# EAGLE design Water_Bird_wagtail (EAGLE 7.3.0)
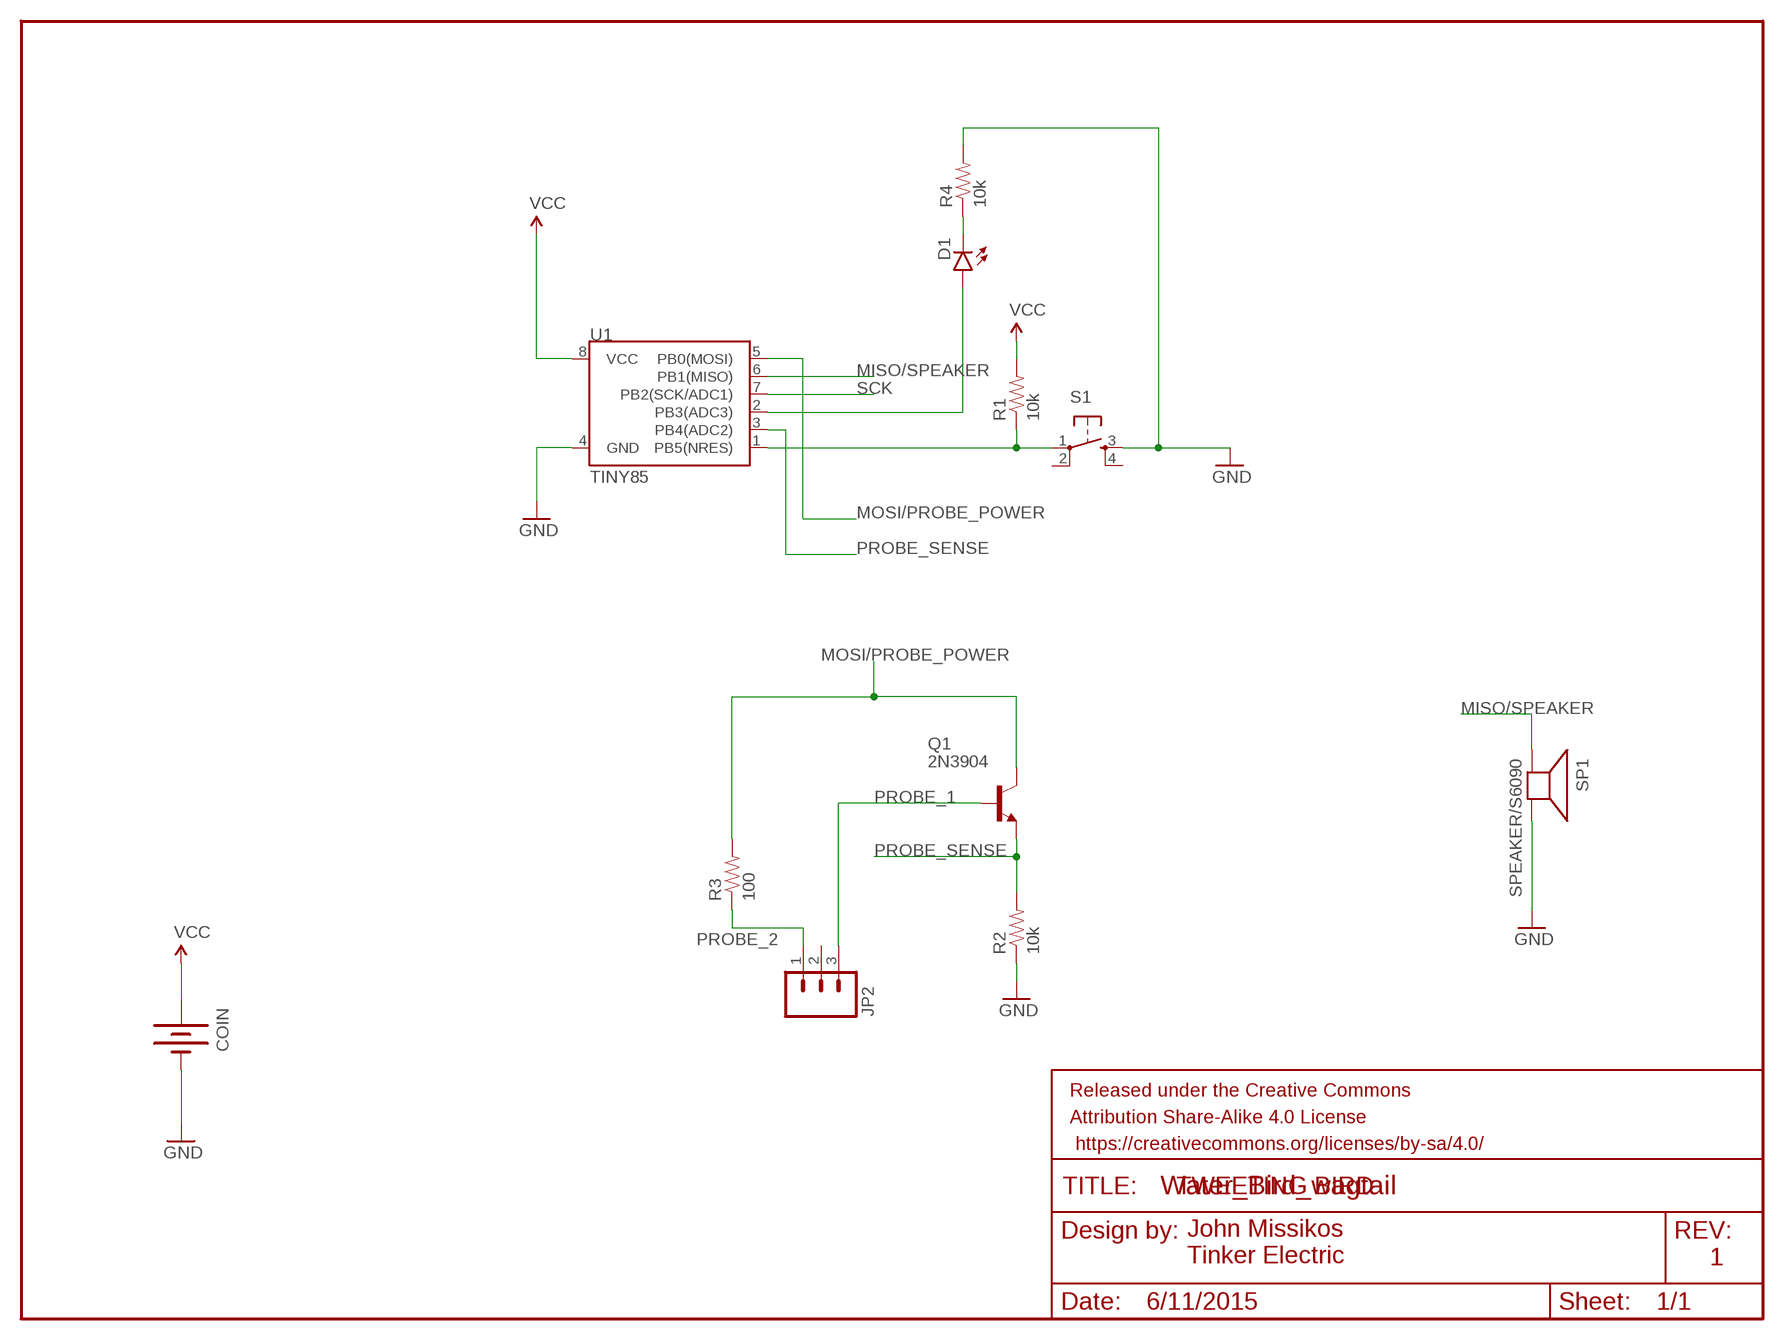
[diagram p0: schematic, sheet 1]

## Parts
COIN  BATTERY_20MM20PTH  [BATTCOM_20MM_PTH]
D1  LED5MM  [LED5MM]
FRAME1  FRAME-LETTERNO_PACKAGE  [DUMMY]
JP2  M03-SCREW-5MM  [SCREWTERMINAL-5MM-3]
Q1  2N3904  2N2222  [TO92-EBC-OVAL]
R1  10k  RESISTORAXIAL-0.3  [AXIAL-0.3]
R2  10k  RESISTORAXIAL-0.3  [AXIAL-0.3]
R3  100  RESISTORAXIAL-0.3  [AXIAL-0.3]
R4  10k  RESISTORAXIAL-0.3  [AXIAL-0.3]
S1  TAC_SWITCHPTH  [TACTILE-PTH]
SP1  SPEAKER/S6090  [S6090]
U1  TINY85  ATTINY45TINY85-20-DIP  [DIP08]

## Nets
GND: COIN.2(-) R2.P$1 R4.P$2 S1.3 SP1.2(-) U1.4(GND)
MISO/SPEAKER: SP1.1(+) U1.6(PB1(MISO))
MOSI/PROBE_POWER: Q1.C R3.P$2 U1.5(PB0(MOSI))
N$1: D1.A U1.2(PB3(ADC3))
N$3: D1.K(C) R4.P$1
PROBE_1: JP2.3 Q1.B
PROBE_2: JP2.1 R3.P$1
PROBE_SENSE: Q1.E R2.P$2 U1.3(PB4(ADC2))
RESET: R1.P$1 S1.1 U1.1(PB5(NRES))
SCK: U1.7(PB2(SCK/ADC1))
VCC: COIN.1(+) R1.P$2 U1.8(VCC)
Unconnected: JP2.2 S1.2 S1.4

## Notes on the sheet
- TWEETING BIRD
- John Missikos
  Tinker Electric
- 1
- 6/11/2015

## Library data of the parts
COIN = TinkerElectric:BATTERY_20MM: Battery Holders Various common sizes : AA, AAA, 18650 (PRT-12895), 20mm coin cell and 12mm coin cell. 20MM_4LEGS, BATT-10373
D1 = SparkFun-LED:LED: LEDs Standard schematic elements and footprints for 5mm, 3mm, 1206, and 0603 sized LEDs. 5mm - Spark Fun Electronics SKU : COM-00529 (and others)
FRAME1 = SparkFun-Aesthetics:FRAME-LETTER: Schematic Frame Standard 8.5x11 US Letter frame; DESIGNER: JM; VERSION: v01
JP2 = SparkFun-Connectors:M03: Header 3 Standard 3-pin 0.1" header. Use with straight break away headers (SKU : PRT-00116), right angle break away headers (PRT-00553), swiss pins (PRT-00743), machine pins (PRT-00117), and female headers (PRT-00115). Molex polarized connector foot print use with SKU : PRT-08232 with associated crimp pins and housings.; STOREFRONT_ID: PRT-08433
Q1 = adafruit:2N2222: NPN TRANSISTOR Big oval pads
R1-R4 = SparkFun-Passives:RESISTOR: Resistor Basic schematic elements and footprints for 0603, 1206, and PTH resistors.
S1 = SparkFun-Retired:TAC_SWITCH: Momentary Switch Button commonly used for reset or general input. Spark Fun Electronics SKU : COM-00097 SMT- SWCH-08247
SP1 = TinkerElectric:SPEAKER: SPEAKER Source: Buerklin Added PS12 (for part # PS1240 piezo) http://www.ladyada.net/library/pcb/eaglelibrary.html
U1 = SparkFun-DigitalIC:ATTINY45: Atmel 8-pin 2/4/8kB flash uC; PROD_ID: IC-09445; VALUE: TINY85-20-DIP

## Board
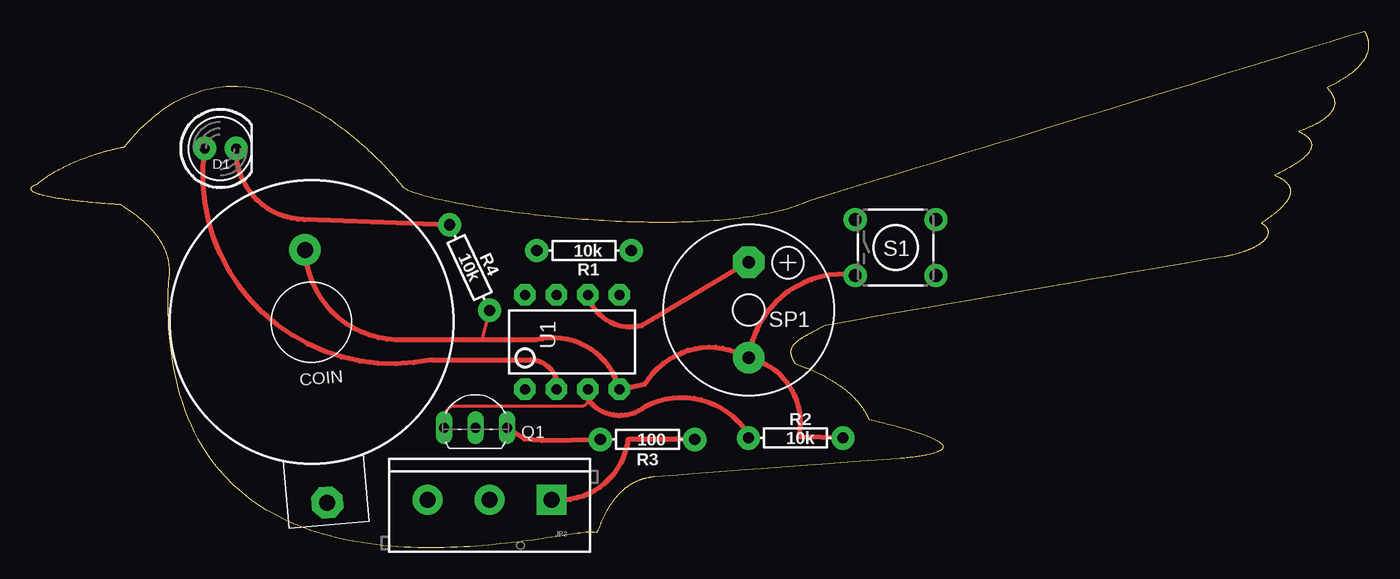
[diagram p1: board, top side]
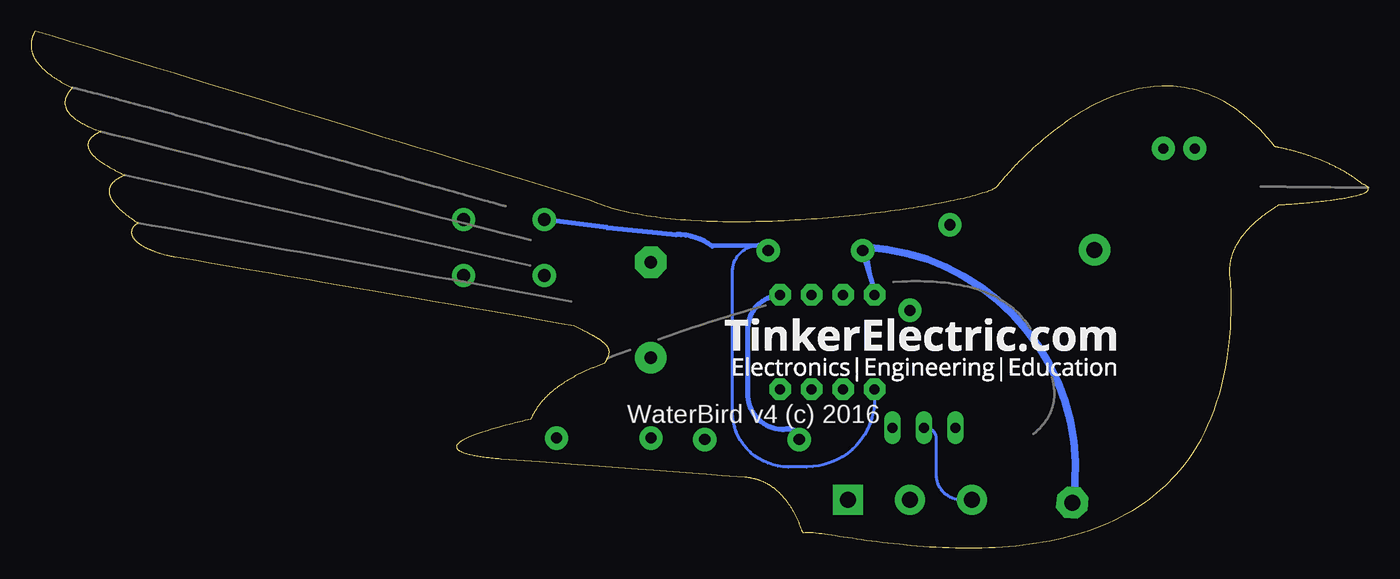
[diagram p2: board, bottom side, seen from below]

Size 107.9 x 41.72 mm. Coordinates in mm from the lower left corner, seen from the top.
Outline: 96.6,23.57 94.56,23.22 93.55,23.04 90.5,22.52 89.48,22.34 88.46,22.17 87.45,21.99 85.42,21.64 84.4,21.46 81.35,20.94 80.33,20.76 78.3,20.41 77.28,20.23 75.25,19.88 74.23,19.71 72.2,19.36 71.19,19.18 68.14,18.65 67.12,18.48 65.09,18.13 64.07,17.95 63.99,17.91 63.91,17.87 63.83,17.83 63.76,17.79 63.68,17.75 63.61,17.71 63.53,17.67 63.46,17.63 63.39,17.59 63.32,17.56 63.25,17.52 63.18,17.49 63.12,17.45 63.05,17.42 62.99,17.38 62.93,17.35 62.87,17.31 62.81,17.28 62.75,17.25 62.69,17.22 62.63,17.18 62.58,17.15 62.52,17.12 62.47,17.09 62.42,17.06 62.37,17.03 62.32,17 62.27,16.97 62.22,16.94 62.18,16.91 62.13,16.88 62.09,16.86 62.05,16.83 62.01,16.8 61.97,16.77 61.89,16.72 61.85,16.69 61.82,16.66 61.78,16.63 61.75,16.61 61.72,16.58 61.69,16.55 61.66,16.53 61.63,16.5 61.6,16.47 61.58,16.44 61.55,16.42 61.53,16.39 61.51,16.36 61.48,16.34 61.46,16.31 61.44,16.28 61.41,16.23 61.39,16.2 61.38,16.17 61.36,16.15 61.35,16.12 61.34,16.09 61.33,16.06 61.32,16.04 61.31,16.01 61.3,15.98 61.3,15.95 61.29,15.92 61.29,15.89 61.28,15.86 61.28,15.83 61.28,15.8 61.28,15.77 61.28,15.74 61.29,15.71 61.29,15.68 61.3,15.62 61.31,15.58 61.32,15.55 61.32,15.52 61.33,15.48 61.35,15.45 61.36,15.41 61.37,15.38 61.39,15.34 61.4,15.31 61.42,15.27 61.43,15.23 61.45,15.2 61.47,15.16 61.49,15.12 61.51,15.08 61.54,15.04 61.56,15 61.59,14.96 61.61,14.92 61.64,14.87 61.74,14.84 61.84,14.8 61.94,14.76 62.04,14.73 62.14,14.69 62.23,14.65 62.33,14.61 62.42,14.58 62.52,14.54 62.61,14.5 62.7,14.46 62.8,14.42 62.89,14.38 62.98,14.34 63.07,14.31 63.15,14.27 63.24,14.23 63.33,14.19 63.41,14.15 63.5,14.1 63.58,14.06 63.67,14.02 63.75,13.98 63.83,13.94 63.91,13.9 63.99,13.86 64.15,13.77 64.23,13.73 64.3,13.69 64.38,13.64 64.45,13.6 64.53,13.56 64.6,13.51 64.67,13.47 64.74,13.42 64.82,13.38 64.89,13.34 64.95,13.29 65.02,13.25 65.09,13.2 65.16,13.15 65.22,13.11 65.29,13.06 65.35,13.02 65.42,12.97 65.48,12.92 65.54,12.88 65.6,12.83 65.66,12.78 65.78,12.69 65.84,12.64 65.89,12.59 65.95,12.54 66.01,12.49 66.06,12.44 66.12,12.4 66.17,12.35 66.22,12.3 66.27,12.25 66.32,12.2 66.37,12.15 66.42,12.1 66.47,12.05 66.52,11.99 66.56,11.94 66.61,11.89 66.7,11.79 66.74,11.74 66.79,11.69 66.83,11.63 66.87,11.58 66.91,11.53 66.95,11.48 66.99,11.42 67.03,11.37 67.07,11.32 67.1,11.26 67.17,11.15 67.21,11.1 67.24,11.04 67.27,10.99 67.31,10.93 67.37,10.82 67.4,10.77 67.43,10.71 67.45,10.66 67.48,10.6 67.51,10.54 67.54,10.49 67.56,10.43 67.58,10.37 67.81,10.32 68.03,10.27 68.24,10.22 68.45,10.17 68.65,10.12 68.85,10.07 69.05,10.02 69.24,9.97 69.61,9.87 69.79,9.83 70.14,9.73 70.31,9.69 70.47,9.64 70.63,9.59 70.78,9.55 71.08,9.46 71.22,9.41 71.49,9.33 71.62,9.28 71.74,9.24 71.87,9.2 71.98,9.16 72.09,9.12 72.2,9.08 72.31,9.03 72.41,8.99 72.51,8.95 72.6,8.91 72.68,8.88 72.77,8.84 72.85,8.8 73,8.72 73.06,8.69 73.18,8.61 73.24,8.58 73.29,8.54 73.34,8.51 73.38,8.47 73.41,8.44 73.45,8.4 73.48,8.37 73.5,8.34 73.53,8.3 73.55,8.27 73.56,8.24 73.57,8.21 73.57,8.18 73.57,8.11 73.57,8.08 73.55,8.06 73.54,8.03 73.52,8 73.5,7.97 73.47,7.94 73.44,7.91 73.4,7.88 73.36,7.86 73.32,7.83 73.22,7.78 73.17,7.75 73.1,7.73 73.04,7.7 72.97,7.68 72.83,7.63 72.75,7.61 72.66,7.59 72.57,7.56 72.48,7.54 72.28,7.5 72.18,7.48 72.07,7.46 71.96,7.44 71.84,7.42 71.72,7.4 71.6,7.38 71.47,7.36 71.33,7.34 71.2,7.32 71.06,7.31 70.91,7.29 70.77,7.27 70.61,7.25 70.45,7.24 70.3,7.22 70.13,7.21 69.96,7.19 69.35,7.15 67.51,7.01 66.89,6.97 63.82,6.74 63.21,6.69 62.59,6.65 58.91,6.37 58.3,6.33 57.68,6.28 54,6.01 53.39,5.96 52.16,5.87 51.55,5.82 50.32,5.73 50.26,5.73 50.2,5.72 50.14,5.71 50.08,5.71 50.02,5.7 49.96,5.69 49.9,5.68 49.84,5.67 49.78,5.65 49.72,5.64 49.66,5.63 49.61,5.61 49.55,5.6 49.49,5.58 49.43,5.57 49.37,5.55 49.32,5.53 49.26,5.52 49.2,5.5 49.15,5.48 49.09,5.46 49.03,5.43 48.98,5.41 48.87,5.37 48.81,5.34 48.76,5.31 48.7,5.29 48.65,5.26 48.59,5.23 48.54,5.2 48.49,5.17 48.43,5.14 48.38,5.11 48.33,5.08 48.27,5.04 48.22,5.01 48.17,4.98 48.07,4.9 48.01,4.86 47.96,4.82 47.91,4.79 47.86,4.74 47.76,4.66 47.71,4.62 47.61,4.53 47.56,4.48 47.51,4.43 47.47,4.38 47.42,4.33 47.37,4.28 47.32,4.23 47.27,4.18 47.23,4.12 47.18,4.07 47.13,4.01 47.09,3.96 47.04,3.9 47,3.84 46.95,3.78 46.91,3.72 46.86,3.66 46.77,3.53 46.73,3.46 46.64,3.33 46.6,3.26 46.52,3.12 46.48,3.04 46.43,2.97 46.39,2.9 46.35,2.82 46.31,2.74 46.27,2.67 46.23,2.59 46.19,2.5 46.15,2.42 46.12,2.34 46.04,2.17 46,2.08 45.96,2 45.93,1.91 45.89,1.82 45.85,1.72 45.82,1.63 45.78,1.54 45.75,1.44 45.71,1.35 45.7,1.38 45.66,1.28 45.63,1.24 45.61,1.22 45.47,1.26 45.37,1.27 45.24,1.27 45.11,1.27 44.95,1.26 44.76,1.24 44.57,1.22 44.35,1.19 44.11,1.16 43.86,1.12 43.59,1.09 43.3,1.04 43.01,1 42.69,0.95 42.35,0.9 42.01,0.85 41.65,0.79 41.27,0.74 40.89,0.68 40.49,0.63 40.07,0.57 39.65,0.52 39.22,0.46 38.32,0.36 37.85,0.31 36.9,0.22 36.41,0.17 35.91,0.14 35.41,0.1 34.9,0.07 34.38,0.05 33.86,0.03 33.34,0.01 32.8,0.01 32.27,0 31.73,0 31.19,0.02 30.64,0.03 30.1,0.06 29.55,0.09 29,0.13 28.45,0.18 27.9,0.25 27.35,0.31 26.8,0.39 26.25,0.49 25.71,0.58 25.17,0.69 24.63,0.82 24.09,0.95 23.56,1.1 22.5,1.43 21.99,1.62 21.48,1.83 20.97,2.04 20.47,2.26 19.49,2.77 19.02,3.04 18.09,3.64 17.64,3.97 16.78,4.67 16.36,5.04 15.57,5.85 15.19,6.29 14.83,6.75 14.47,7.21 14.14,7.71 13.82,8.23 13.51,8.76 13.22,9.31 12.95,9.9 12.68,10.49 12.44,11.11 12.23,11.77 12.01,12.43 11.82,13.12 11.67,13.85 11.51,14.58 11.38,15.34 11.19,16.95 11.12,17.8 11.06,19.56 11.07,20.48 11.11,21.45 11.12,21.53 11.13,21.6 11.14,21.68 11.15,21.76 11.16,21.83 11.18,21.99 11.18,22.06 11.19,22.21 11.19,22.29 11.19,22.36 11.19,22.44 11.18,22.51 11.18,22.58 11.18,22.66 11.17,22.73 11.16,22.8 11.15,22.87 11.14,22.95 11.12,23.09 11.1,23.16 11.09,23.23 11.07,23.3 11.06,23.37 11.04,23.44 11.02,23.51 11,23.58 10.98,23.65 10.95,23.72 10.93,23.79 10.9,23.86 10.88,23.93 10.85,23.99 10.82,24.06 10.79,24.13 10.76,24.2 10.73,24.26 10.69,24.33 10.66,24.4 10.62,24.46 10.59,24.53 10.55,24.59 10.47,24.73 10.43,24.79 10.39,24.86 10.35,24.92 10.3,24.98 10.21,25.11 10.16,25.17 10.11,25.24 10.07,25.3 10.02,25.36 9.96,25.43 9.91,25.49 9.86,25.55 9.8,25.61 9.75,25.67 9.69,25.74 9.64,25.8 9.58,25.86 9.52,25.92 9.46,25.98 9.4,26.04 9.33,26.1 9.27,26.16 9.21,26.22 9.14,26.28 9.01,26.4 8.94,26.45 8.87,26.51 8.8,26.57 8.73,26.63 8.66,26.69 8.59,26.74 8.52,26.8 8.37,26.92 8.29,26.97 8.14,27.09 8.06,27.14 7.9,27.25 7.82,27.31 7.65,27.42 7.57,27.47 7.48,27.53 7.4,27.58 7.31,27.64 7.23,27.69 7.22,27.69 7.18,27.69 7.15,27.7 7.12,27.7 7.09,27.7 7.04,27.7 6.99,27.71 6.94,27.71 6.89,27.71 6.82,27.72 6.76,27.72 6.69,27.73 6.62,27.73 6.54,27.74 6.46,27.74 6.37,27.75 6.28,27.75 6.19,27.76 6,27.78 5.9,27.78 5.79,27.79 5.69,27.8 5.58,27.81 5.35,27.83 5.24,27.84 5,27.86 4.88,27.87 4.75,27.88 4.63,27.89 4.51,27.91 4.25,27.93 4.13,27.95 4,27.96 3.87,27.97 3.74,27.99 3.61,28 3.48,28.02 3.35,28.03 3.1,28.07 2.97,28.08 2.84,28.1 2.71,28.12 2.59,28.13 2.47,28.15 2.34,28.17 2.22,28.19 2.1,28.21 1.99,28.23 1.87,28.25 1.64,28.29 1.54,28.31 1.43,28.33 1.32,28.35 1.22,28.38 1.03,28.42 0.94,28.45 0.85,28.47 0.76,28.49 0.68,28.52 0.61,28.54 0.53,28.57 0.46,28.6 0.4,28.62 0.34,28.65 0.28,28.68 0.23,28.7 0.18,28.73 0.14,28.76 0.1,28.79 0.07,28.82 0.04,28.85 0.03,28.88 0.01,28.91 0,28.94 0,29 0.01,29.03 0.03,29.06 0.05,29.09 0.08,29.13 0.16,29.19 0.21,29.23 0.27,29.26 0.33,29.3 0.4,29.33 0.49,29.37 0.58,29.44 0.67,29.51 0.85,29.65 0.94,29.72 1.03,29.78 1.13,29.85 1.22,29.91 1.31,29.97 1.41,30.04 1.51,30.1 1.6,30.16 1.7,30.22 1.8,30.27 1.99,30.39 2.09,30.44 2.19,30.5 2.29,30.55 2.38,30.6 2.48,30.66 2.58,30.71 2.68,30.76 2.78,30.81 2.88,30.85 2.98,30.9 3.08,30.95 3.18,30.99 3.28,31.04 3.38,31.08 3.47,31.12 3.57,31.17 3.67,31.21 3.77,31.25 3.86,31.29 3.96,31.33 4.06,31.36 4.15,31.4 4.25,31.44 4.34,31.47 4.44,31.51 4.53,31.54 4.62,31.57 4.72,31.61 4.81,31.64 4.9,31.67 4.99,31.7 5.07,31.73 5.16,31.76 5.25,31.79 5.33,31.81 5.42,31.84 5.5,31.86 5.59,31.89 5.67,31.91 5.75,31.94 5.83,31.96 5.9,31.98 5.98,32 6.06,32.02 6.13,32.04 6.2,32.06 6.27,32.08 6.34,32.1 6.41,32.12 6.54,32.15 6.6,32.17 6.66,32.18 6.73,32.2 6.78,32.21 6.89,32.23 6.95,32.25 7,32.26 7.04,32.27 7.09,32.28 7.18,32.3 7.22,32.31 7.26,32.31 7.29,32.32 7.33,32.33 7.36,32.33 7.39,32.34 7.41,32.34 7.44,32.35 7.46,32.35 7.48,32.36 7.5,32.36 7.51,32.36 7.52,32.36 7.53,32.37 7.54,32.37 7.54,32.37 7.85,32.75 8.16,33.11 8.79,33.78 9.1,34.09 9.42,34.37 9.73,34.65 10.05,34.92 10.36,35.15 10.68,35.39 11,35.61 11.64,35.99 11.95,36.17 12.27,36.32 12.59,36.47 12.91,36.6 13.23,36.72 13.55,36.83 13.86,36.92 14.18,37 14.5,37.08 14.81,37.14 15.13,37.18 15.44,37.22 15.76,37.25 16.07,37.26 16.38,37.27 16.69,37.27 17.31,37.23 17.61,37.2 18.22,37.11 18.52,37.05 19.12,36.91 19.41,36.83 19.71,36.74 20,36.65 20.29,36.55 20.57,36.44 20.86,36.34 21.14,36.22 21.41,36.09 21.69,35.97 21.96,35.83 22.5,35.55 22.77,35.41 23.02,35.26 23.28,35.1 23.54,34.95 23.79,34.79 24.04,34.63 24.28,34.46 24.52,34.3 24.75,34.13 24.99,33.96 25.44,33.62 25.66,33.45 26.08,33.1 26.29,32.93 26.49,32.76 26.69,32.59 26.88,32.42 27.06,32.25 27.25,32.08 27.42,31.91 27.76,31.59 27.93,31.43 28.23,31.12 28.38,30.97 28.51,30.83 28.65,30.69 28.78,30.55 28.9,30.42 29.02,30.29 29.12,30.17 29.22,30.06 29.33,29.95 29.42,29.84 29.58,29.65 29.65,29.57 29.71,29.49 29.77,29.42 29.82,29.36 29.86,29.31 29.9,29.26 29.93,29.22 29.95,29.19 29.98,29.15 30.03,29.1 30.19,29 30.28,28.95 30.4,28.89 30.51,28.84 30.65,28.79 30.8,28.73 30.96,28.68 31.13,28.62 31.51,28.5 31.71,28.45 31.94,28.39 32.16,28.33 32.4,28.27 32.65,28.21 32.91,28.15 33.17,28.09 33.46,28.03 33.74,27.97 34.04,27.91 34.65,27.79 34.97,27.73 35.31,27.67 35.64,27.61 35.99,27.55 36.34,27.5 36.69,27.44 37.06,27.38 37.81,27.27 38.19,27.22 38.59,27.17 38.98,27.11 39.38,27.06 39.78,27.01 40.19,26.96 40.61,26.92 41.03,26.87 41.44,26.82 41.87,26.78 42.3,26.74 42.73,26.7 43.17,26.66 43.61,26.62 44.04,26.59 44.49,26.55 44.93,26.52 45.38,26.49 45.82,26.46 46.27,26.44 46.72,26.41 47.17,26.39 47.62,26.37 48.07,26.35 48.52,26.34 49.42,26.32 49.87,26.31 50.31,26.31 50.76,26.3 51.2,26.3 51.64,26.31 52.08,26.31 52.52,26.32 52.95,26.34 53.39,26.35 53.82,26.37 54.66,26.41 55.08,26.44 55.49,26.48 55.9,26.51 56.31,26.55 56.7,26.59 57.1,26.63 57.49,26.68 57.87,26.74 58.25,26.79 58.62,26.85 58.98,26.92 59.34,26.99 59.69,27.06 60.03,27.14 60.37,27.22 60.7,27.31 61.01,27.4 61.33,27.49 61.63,27.59 61.92,27.69 62.21,27.8 62.49,27.91 62.75,28.03 64.15,28.46 68.35,29.74 69.75,30.17 71.15,30.6 72.55,31.02 75.35,31.88 76.75,32.31 78.15,32.74 79.55,33.16 80.95,33.59 82.35,34.02 85.16,34.87 86.56,35.3 87.96,35.73 89.36,36.16 93.56,37.44 94.96,37.87 96.36,38.3 97.76,38.72 100.56,39.58 101.96,40.01 103.36,40.43 104.76,40.86 106.16,41.29 107.56,41.72 107.59,41.66 107.62,41.61 107.67,41.5 107.69,41.45 107.74,41.34 107.76,41.29 107.78,41.24 107.8,41.18 107.81,41.13 107.83,41.08 107.84,41.03 107.85,40.98 107.86,40.92 107.87,40.87 107.88,40.82 107.89,40.77 107.89,40.72 107.89,40.67 107.9,40.62 107.9,40.56 107.9,40.51 107.9,40.46 107.89,40.41 107.89,40.36 107.88,40.31 107.88,40.26 107.87,40.21 107.85,40.11 107.84,40.06 107.81,39.96 107.79,39.91 107.77,39.87 107.75,39.82 107.73,39.77 107.71,39.72 107.69,39.67 107.67,39.62 107.62,39.52 107.59,39.48 107.56,39.43 107.53,39.38 107.5,39.33 107.47,39.29 107.43,39.24 107.4,39.19 107.36,39.14 107.33,39.1 107.29,39.05 107.25,39 107.21,38.96 107.16,38.91 107.08,38.82 107.03,38.77 106.98,38.72 106.94,38.68 106.89,38.63 106.84,38.58 106.79,38.54 106.73,38.49 106.68,38.45 106.62,38.4 106.57,38.36 106.45,38.27 106.39,38.22 106.33,38.18 106.27,38.13 106.21,38.09 106.14,38.04 106.08,38 106.01,37.95 105.95,37.91 105.88,37.87 105.81,37.82 105.74,37.78 105.67,37.73 105.6,37.69 105.52,37.65 105.45,37.6 105.37,37.56 105.22,37.47 105.14,37.43 105.06,37.39 104.98,37.34 104.9,37.3 104.81,37.26 104.73,37.22 104.64,37.17 104.56,37.13 104.6,37.09 104.63,37.05 104.7,36.97 104.73,36.93 104.76,36.9 104.79,36.86 104.82,36.82 104.85,36.78 104.88,36.74 104.9,36.7 104.93,36.66 104.95,36.62 104.97,36.58 104.99,36.55 105.01,36.51 105.03,36.47 105.05,36.43 105.06,36.39 105.08,36.35 105.09,36.31 105.11,36.28 105.12,36.24 105.13,36.2 105.14,36.16 105.14,36.12 105.15,36.05 105.16,36.01 105.16,35.97 105.16,35.93 105.16,35.9 105.16,35.86 105.16,35.82 105.15,35.78 105.14,35.71 105.13,35.67 105.11,35.6 105.1,35.56 105.09,35.52 105.07,35.48 105.06,35.45 105.04,35.41 105.02,35.37 105,35.34 104.98,35.3 104.96,35.26 104.94,35.23 104.91,35.19 104.88,35.15 104.86,35.12 104.83,35.08 104.8,35.04 104.76,35.01 104.73,34.97 104.7,34.93 104.66,34.9 104.62,34.86 104.58,34.83 104.54,34.79 104.5,34.75 104.45,34.72 104.41,34.68 104.36,34.65 104.32,34.61 104.27,34.57 104.16,34.5 104.11,34.47 104.05,34.43 104,34.4 103.94,34.36 103.88,34.33 103.82,34.29 103.75,34.26 103.69,34.22 103.62,34.19 103.56,34.15 103.49,34.12 103.42,34.08 103.34,34.05 103.27,34.01 103.2,33.98 103.12,33.94 103.04,33.91 102.96,33.88 102.88,33.84 102.8,33.81 102.71,33.77 102.63,33.74 102.45,33.67 102.36,33.64 102.26,33.6 102.32,33.58 102.37,33.55 102.42,33.53 102.47,33.5 102.52,33.47 102.57,33.45 102.61,33.42 102.66,33.39 102.7,33.37 102.74,33.34 102.78,33.31 102.86,33.26 102.89,33.23 102.93,33.2 102.96,33.17 102.99,33.14 103.02,33.11 103.05,33.08 103.08,33.05 103.1,33.02 103.13,32.99 103.15,32.96 103.19,32.9 103.21,32.87 103.22,32.84 103.24,32.81 103.25,32.78 103.26,32.74 103.28,32.71 103.28,32.68 103.29,32.65 103.3,32.62 103.3,32.58 103.3,32.55 103.31,32.52 103.3,32.48 103.3,32.45 103.3,32.41 103.29,32.38 103.29,32.34 103.28,32.31 103.27,32.27 103.26,32.24 103.24,32.2 103.23,32.17 103.19,32.09 103.17,32.06 103.13,31.98 103.1,31.95 103.07,31.91 103.05,31.87 103.02,31.83 102.98,31.79 102.95,31.75 102.92,31.72 102.88,31.68 102.84,31.64 102.8,31.6 102.71,31.52 102.67,31.48 102.62,31.43 102.57,31.39 102.52,31.35 102.41,31.27 102.35,31.23 102.23,31.14 102.17,31.1 102.11,31.05 102.04,31.01 101.97,30.97 101.83,30.88 101.76,30.83 101.61,30.74 101.53,30.7 101.45,30.65 101.36,30.6 101.28,30.56 101.19,30.51 101.1,30.46 101.01,30.42 100.92,30.37 100.83,30.32 100.73,30.27 100.53,30.17 100.43,30.12 100.32,30.07 100.39,30.05 100.45,30.02 100.5,30 100.56,29.97 100.62,29.94 100.67,29.92 100.72,29.89 100.77,29.86 100.82,29.83 100.87,29.8 100.92,29.77 100.96,29.74 101.01,29.72 101.05,29.69 101.13,29.63 101.16,29.59 101.2,29.56 101.23,29.53 101.27,29.5 101.33,29.44 101.36,29.41 101.38,29.37 101.41,29.34 101.43,29.31 101.45,29.27 101.47,29.24 101.49,29.2 101.51,29.17 101.53,29.14 101.54,29.1 101.56,29.03 101.57,28.99 101.58,28.96 101.59,28.92 101.59,28.88 101.6,28.85 101.6,28.81 101.6,28.77 101.6,28.69 101.59,28.66 101.59,28.62 101.58,28.58 101.57,28.54 101.56,28.5 101.55,28.46 101.54,28.42 101.52,28.38 101.51,28.34 101.49,28.29 101.47,28.25 101.45,28.21 101.43,28.17 101.4,28.13 101.38,28.08 101.35,28.04 101.32,28 101.29,27.95 101.26,27.91 101.19,27.82 101.16,27.77 101.12,27.73 101.08,27.68 101.04,27.64 101,27.59 100.95,27.54 100.91,27.5 100.86,27.45 100.81,27.4 100.76,27.36 100.71,27.31 100.66,27.26 100.6,27.21 100.54,27.16 100.49,27.11 100.43,27.06 100.31,26.96 100.24,26.91 100.17,26.86 100.11,26.81 100.04,26.76 99.97,26.71 99.9,26.66 99.82,26.6 99.75,26.55 99.67,26.5 99.59,26.44 99.51,26.39 99.43,26.34 99.35,26.28 99.27,26.23 99.31,26.2 99.35,26.17 99.39,26.15 99.42,26.12 99.46,26.09 99.49,26.06 99.52,26.03 99.55,26 99.61,25.94 99.63,25.91 99.65,25.88 99.67,25.85 99.69,25.82 99.71,25.79 99.73,25.76 99.74,25.73 99.75,25.7 99.77,25.67 99.77,25.64 99.78,25.61 99.79,25.57 99.79,25.54 99.8,25.51 99.8,25.48 99.8,25.45 99.79,25.42 99.79,25.38 99.79,25.35 99.78,25.32 99.77,25.29 99.76,25.25 99.75,25.22 99.74,25.19 99.72,25.16 99.71,25.13 99.69,25.09 99.67,25.06 99.63,25 99.61,24.96 99.58,24.93 99.56,24.9 99.53,24.87 99.5,24.84 99.47,24.8 99.44,24.77 99.4,24.74 99.37,24.71 99.33,24.68 99.29,24.65 99.26,24.62 99.22,24.58 99.13,24.52 99.09,24.49 99.04,24.46 98.99,24.43 98.94,24.4 98.84,24.34 98.79,24.31 98.68,24.25 98.62,24.22 98.56,24.2 98.5,24.17 98.44,24.14 98.38,24.11 98.32,24.08 98.25,24.06 98.19,24.03 98.12,24 98.05,23.98 97.91,23.92 97.84,23.9 97.77,23.87 97.69,23.85 97.62,23.82 97.54,23.8 97.46,23.78 97.38,23.75 97.22,23.71 97.14,23.69 96.97,23.64 96.88,23.62 96.8,23.6 96.71,23.58 96.62,23.56 96.53,23.54 96.44,23.52 96.34,23.51 96.25,23.49
Copper layers (1*16): Top 0.035mm / dielectric 1.5mm / Bottom 0.035mm
Design rules "default": minimum track width 10mil, minimum drill 24mil, track to track 8mil, track to pad 8mil, pad to pad 8mil, via to via 8mil, smd to smd 8mil, copper to edge 40mil, drill to drill 8mil, minimum pad ring 10mil, minimum via ring 8mil, stop-mask expansion 4mil, vias tented up to drill 0mil, thermal gap 10mil

### Footprints (pad centres in the part's own frame; a part is rotated, then mirrored left to right if it is on the bottom)
BATTCOM_20MM_PTH = drill 1.3 pad 2.54 octagon: 1 14.63,0 | drill 1.3 pad 2.54: 2 -5.842,0
LED5MM = drill 0.813 pad 1.88: A -1.27,0; K 1.27,0
SCREWTERMINAL-5MM-3 = drill 1.3 pad 2.413 square: 1 0,0 | drill 1.3 pad 2.413: 2 5,0; 3 10,0
TO92-EBC-OVAL = drill 0.813 long: B 0,-1.27; C 2.54,-1.27; E -2.54,-1.27
AXIAL-0.3 = drill 0.9 pad 1.88: P$1 -3.81,0; P$2 3.81,0
TACTILE-PTH = drill 1.016 pad 1.88: 1 -3.251,2.261; 2 3.251,2.261; 3 -3.251,-2.261; 4 3.251,-2.261
S6090 = drill 1.016 pad 2.54 octagon: 1 -3.861,0 | drill 1.016 pad 2.54: 2 3.861,0
DIP08 = drill 0.813 pad 1.727 octagon: 1 -3.81,-3.81; 2 -1.27,-3.81; 3 1.27,-3.81; 4 3.81,-3.81; 5 3.81,3.81; 6 1.27,3.81; 7 -1.27,3.81; 8 -3.81,3.81

### Placement (x,y rotation side)
COIN  22.62,18.22 275 top
D1  15.27,32.23 0 top
FRAME1  -9.47,-12.18 0 top  (outside the outline)
JP2  41.99,3.88 180 top
Q1  35.85,10.97 0 top
R1  44.62,23.99 180 top
R2  61.68,8.87 180 top
R3  49.74,8.74 180 top
R4  35.38,22.62 295 top
S1  69.75,24.24 0 top
SP1  57.89,19.2 270 top
U1  43.66,16.61 0 top

### Tracks (layer width: path | path; a pad name or v marks a point on that pad's centre or on a via)
GND
  Top 0.254: R4.P$2 36.36,16.79
  Top 0.4: S1.3 66.54,22.03 66.48,22.03 arc90 SP1.2 | 47.62,12.76 U1.4 | COIN.2 arc90 30.11,16.79 36.36,16.79 40.77,16.79 arc-90 U1.4 | U1.4 49.53,13.22 arc-90 SP1.2 | R2.P$1 61.95,8.96 arc90 SP1.2
MISO/SPEAKER
  Top 0.4: SP1.1 49.28,17.94 arc-90 U1.6
MOSI/PROBE_POWER
  Top 0.4: Q1.C 39.82,8.79 40.49,8.72 41.21,8.66 R3.P$2
  Bottom 0.254: R3.P$2 45.71,8.71
  Bottom 0.406: 45.71,8.71 arc-90 47.19,9.55 47.32,9.55 arc90 50.06,12.5 50.06,17.39 arc90 U1.5
N$1
  Top 0.4: U1.2 42.48,12.85 arc90 40.34,15.18 32.34,15.18 arc-110 D1.A
N$3
  Top 0.4: R4.P$1 22.05,26.49 arc-90 D1.K
PROBE_1
  Bottom 0.254: JP2.3 32.85,3.88 arc90 34.86,5.9 34.86,8.92 arc-90 Q1.B
PROBE_2
  Top 0.4: 42.15,3.78 JP2.1 arc90 48.15,8.75 R3.P$1
PROBE_SENSE
  Top 0.254: Q1.E 33.31,9.69 arc-90 34.01,11.45 44.3,11.45 arc90 44.97,11.91
  Top 0.4: U1.3 44.97,11.91 arc90 49.54,11.41 arc-90 58.07,8.8 R2.P$2
RESET
  Bottom 0.254: U1.1 39.85,12.02 arc90 45.33,6.54 46.83,6.54 arc90 51.32,11.02 51.32,22.27 arc90 49.18,24.41
  Bottom 0.4: S1.1 61.4,25.84 55.84,25.27 arc38 52.95,24.35 49.18,24.41 R1.P$1
VCC
  Bottom 0.254: U1.8 40.5,24.27 | 23.67,3.87 arc90 COIN.1
  Bottom 0.4: U1.8 39.79,20.61 R1.P$2
  Bottom 0.6: 40.5,24.27 arc90 23.67,5.3 23.67,3.87

### Text on the board
bNames: WaterBird v4 (c) 2016